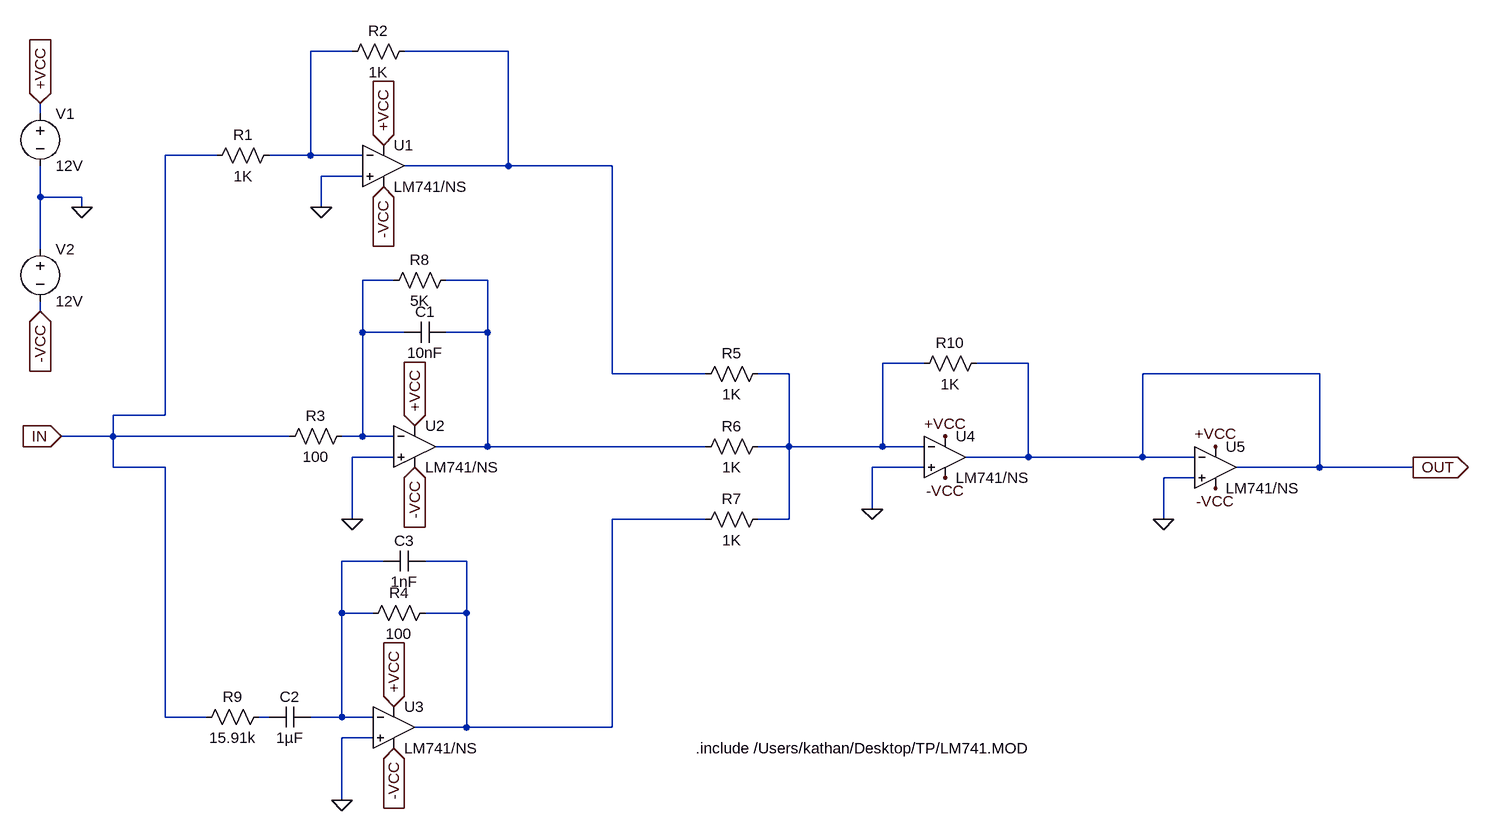
[diagram p0: schematic PID.asc]
PID.asc, the LTspice schematic file:
Version 4
SHEET 1 1940 1172
WIRE 80 -80 16 -80
WIRE 320 -80 160 -80
WIRE -400 16 -400 0
WIRE -128 80 -208 80
WIRE 16 80 16 -80
WIRE 16 80 -48 80
WIRE 96 80 16 80
WIRE 320 96 320 -80
WIRE 320 96 160 96
WIRE 480 96 320 96
WIRE 96 112 32 112
WIRE -400 144 -400 96
WIRE -336 144 -400 144
WIRE -336 160 -336 144
WIRE 32 160 32 112
WIRE -400 224 -400 144
WIRE 144 272 96 272
WIRE 288 272 224 272
WIRE -400 320 -400 304
WIRE 96 352 96 272
WIRE 160 352 96 352
WIRE 288 352 288 272
WIRE 288 352 224 352
WIRE 960 400 896 400
WIRE 1120 400 1040 400
WIRE 480 416 480 96
WIRE 624 416 480 416
WIRE 752 416 704 416
WIRE 1568 416 1296 416
WIRE -208 480 -208 80
WIRE -208 480 -288 480
WIRE -288 512 -288 480
WIRE -288 512 -368 512
WIRE -16 512 -288 512
WIRE 96 512 96 352
WIRE 96 512 64 512
WIRE 144 512 96 512
WIRE 288 528 288 352
WIRE 288 528 208 528
WIRE 624 528 288 528
WIRE 752 528 752 416
WIRE 752 528 704 528
WIRE 896 528 896 400
WIRE 896 528 752 528
WIRE 960 528 896 528
WIRE 144 544 80 544
WIRE 1120 544 1120 400
WIRE 1120 544 1024 544
WIRE 1296 544 1296 416
WIRE 1296 544 1120 544
WIRE 1376 544 1296 544
WIRE -288 560 -288 512
WIRE -208 560 -288 560
WIRE 960 560 880 560
WIRE 1568 560 1568 416
WIRE 1568 560 1440 560
WIRE 1712 560 1568 560
WIRE 1376 576 1328 576
WIRE 880 624 880 560
WIRE 80 640 80 544
WIRE 624 640 480 640
WIRE 752 640 752 528
WIRE 752 640 704 640
WIRE 1328 640 1328 576
WIRE 128 704 64 704
WIRE 256 704 192 704
WIRE 64 784 64 704
WIRE 112 784 64 784
WIRE 256 784 256 704
WIRE 256 784 192 784
WIRE -208 944 -208 560
WIRE -144 944 -208 944
WIRE -48 944 -64 944
WIRE 64 944 64 784
WIRE 64 944 16 944
WIRE 112 944 64 944
WIRE 256 960 256 784
WIRE 256 960 176 960
WIRE 480 960 480 640
WIRE 480 960 256 960
WIRE 112 976 64 976
WIRE 64 1072 64 976
FLAG -336 160 0
FLAG -400 0 +VCC
IOPIN -400 0 In
FLAG -400 320 -VCC
IOPIN -400 320 In
FLAG 128 64 +VCC
IOPIN 128 64 In
FLAG 128 128 -VCC
IOPIN 128 128 In
FLAG 176 496 +VCC
IOPIN 176 496 In
FLAG 176 560 -VCC
IOPIN 176 560 In
FLAG 144 928 +VCC
IOPIN 144 928 In
FLAG 144 992 -VCC
IOPIN 144 992 In
FLAG 32 160 0
FLAG 80 640 0
FLAG 64 1072 0
FLAG -368 512 IN
IOPIN -368 512 In
FLAG 880 624 0
FLAG 992 512 +VCC
FLAG 992 576 -VCC
FLAG 1408 528 +VCC
FLAG 1408 592 -VCC
FLAG 1328 640 0
FLAG 1712 560 OUT
IOPIN 1712 560 Out
SYMBOL OpAmps\\opamp2 128 32 R0
SYMATTR InstName U1
SYMATTR Value LM741/NS
SYMBOL OpAmps\\opamp2 176 464 R0
SYMATTR InstName U2
SYMATTR Value LM741/NS
SYMBOL OpAmps\\opamp2 144 896 R0
SYMATTR InstName U3
SYMATTR Value LM741/NS
SYMBOL voltage -400 0 R0
WINDOW 123 0 0 Left 0
WINDOW 39 0 0 Left 0
SYMATTR InstName V1
SYMATTR Value 12V
SYMBOL voltage -400 208 R0
WINDOW 123 0 0 Left 0
WINDOW 39 0 0 Left 0
SYMATTR InstName V2
SYMATTR Value 12V
SYMBOL res -32 64 R90
WINDOW 0 0 56 VBottom 2
WINDOW 3 32 56 VTop 2
SYMATTR InstName R1
SYMATTR Value 1K
SYMBOL res 176 -96 R90
WINDOW 0 0 56 VBottom 2
WINDOW 3 32 56 VTop 2
SYMATTR InstName R2
SYMATTR Value 1K
SYMBOL cap 224 336 R90
WINDOW 0 0 32 VBottom 2
WINDOW 3 32 32 VTop 2
SYMATTR InstName C1
SYMATTR Value 10nF
SYMBOL res 80 496 R90
WINDOW 0 0 56 VBottom 2
WINDOW 3 32 56 VTop 2
SYMATTR InstName R3
SYMATTR Value 100
SYMBOL cap 16 928 R90
WINDOW 0 0 32 VBottom 2
WINDOW 3 32 32 VTop 2
SYMATTR InstName C2
SYMATTR Value 1µF
SYMBOL res 208 768 R90
WINDOW 0 0 56 VBottom 2
WINDOW 3 32 56 VTop 2
SYMATTR InstName R4
SYMATTR Value 100
SYMBOL OpAmps\\opamp2 992 480 R0
SYMATTR InstName U4
SYMATTR Value LM741/NS
SYMBOL res 720 400 R90
WINDOW 0 0 56 VBottom 2
WINDOW 3 32 56 VTop 2
SYMATTR InstName R5
SYMATTR Value 1K
SYMBOL res 720 512 R90
WINDOW 0 0 56 VBottom 2
WINDOW 3 32 56 VTop 2
SYMATTR InstName R6
SYMATTR Value 1K
SYMBOL res 720 624 R90
WINDOW 0 0 56 VBottom 2
WINDOW 3 32 56 VTop 2
SYMATTR InstName R7
SYMATTR Value 1K
SYMBOL OpAmps\\opamp2 1408 496 R0
SYMATTR InstName U5
SYMATTR Value LM741/NS
SYMBOL res 240 256 R90
WINDOW 0 0 56 VBottom 2
WINDOW 3 32 56 VTop 2
SYMATTR InstName R8
SYMATTR Value 5K
SYMBOL res -48 928 R90
WINDOW 0 0 56 VBottom 2
WINDOW 3 32 56 VTop 2
SYMATTR InstName R9
SYMATTR Value 15.91k
SYMBOL cap 192 688 R90
WINDOW 0 0 32 VBottom 2
WINDOW 3 32 32 VTop 2
SYMATTR InstName C3
SYMATTR Value 1nF
SYMBOL res 1056 384 R90
WINDOW 0 0 56 VBottom 2
WINDOW 3 32 56 VTop 2
SYMATTR InstName R10
SYMATTR Value 1K
TEXT 608 992 Left 2 !.include /Users/kathan/Desktop/TP/LM741.MOD

The netlist it stands for:
* PID.asc
XU1 0 N001 +VCC -VCC N002 LM741/NS  ; pins In+ In- V+ V- OUT
XU2 0 N003 +VCC -VCC N004 LM741/NS  ; pins In+ In- V+ V- OUT
XU3 0 N007 +VCC -VCC N006 LM741/NS  ; pins In+ In- V+ V- OUT
V1 +VCC 0 12V
V2 0 -VCC 12V
R1 N001 IN 1K
R2 N002 N001 1K
C1 N004 N003 10nF
R3 N003 IN 100
C2 N007 N008 1µF
R4 N006 N007 100
XU4 0 N005 +VCC -VCC OUT LM741/NS  ; pins In+ In- V+ V- OUT
R5 N005 N002 1K
R6 N005 N004 1K
R7 N005 N006 1K
XU5 0 OUT +VCC -VCC OUT LM741/NS  ; pins In+ In- V+ V- OUT
R8 N004 N003 5K
R9 N008 IN 15.91k
C3 N006 N007 1nF
R10 OUT N005 1K
.include /Users/kathan/Desktop/TP/LM741.MOD
.backanno
.end